# EasyEDA schematic 1-Schematic_STM32 Modified.json
TITLE: STM32F103C8T6 Blue Board; REV: 1.1; Date: 2019-03-03; Sheet: 1/1; Drawn By: r3bers; Company: https://solovjov.net
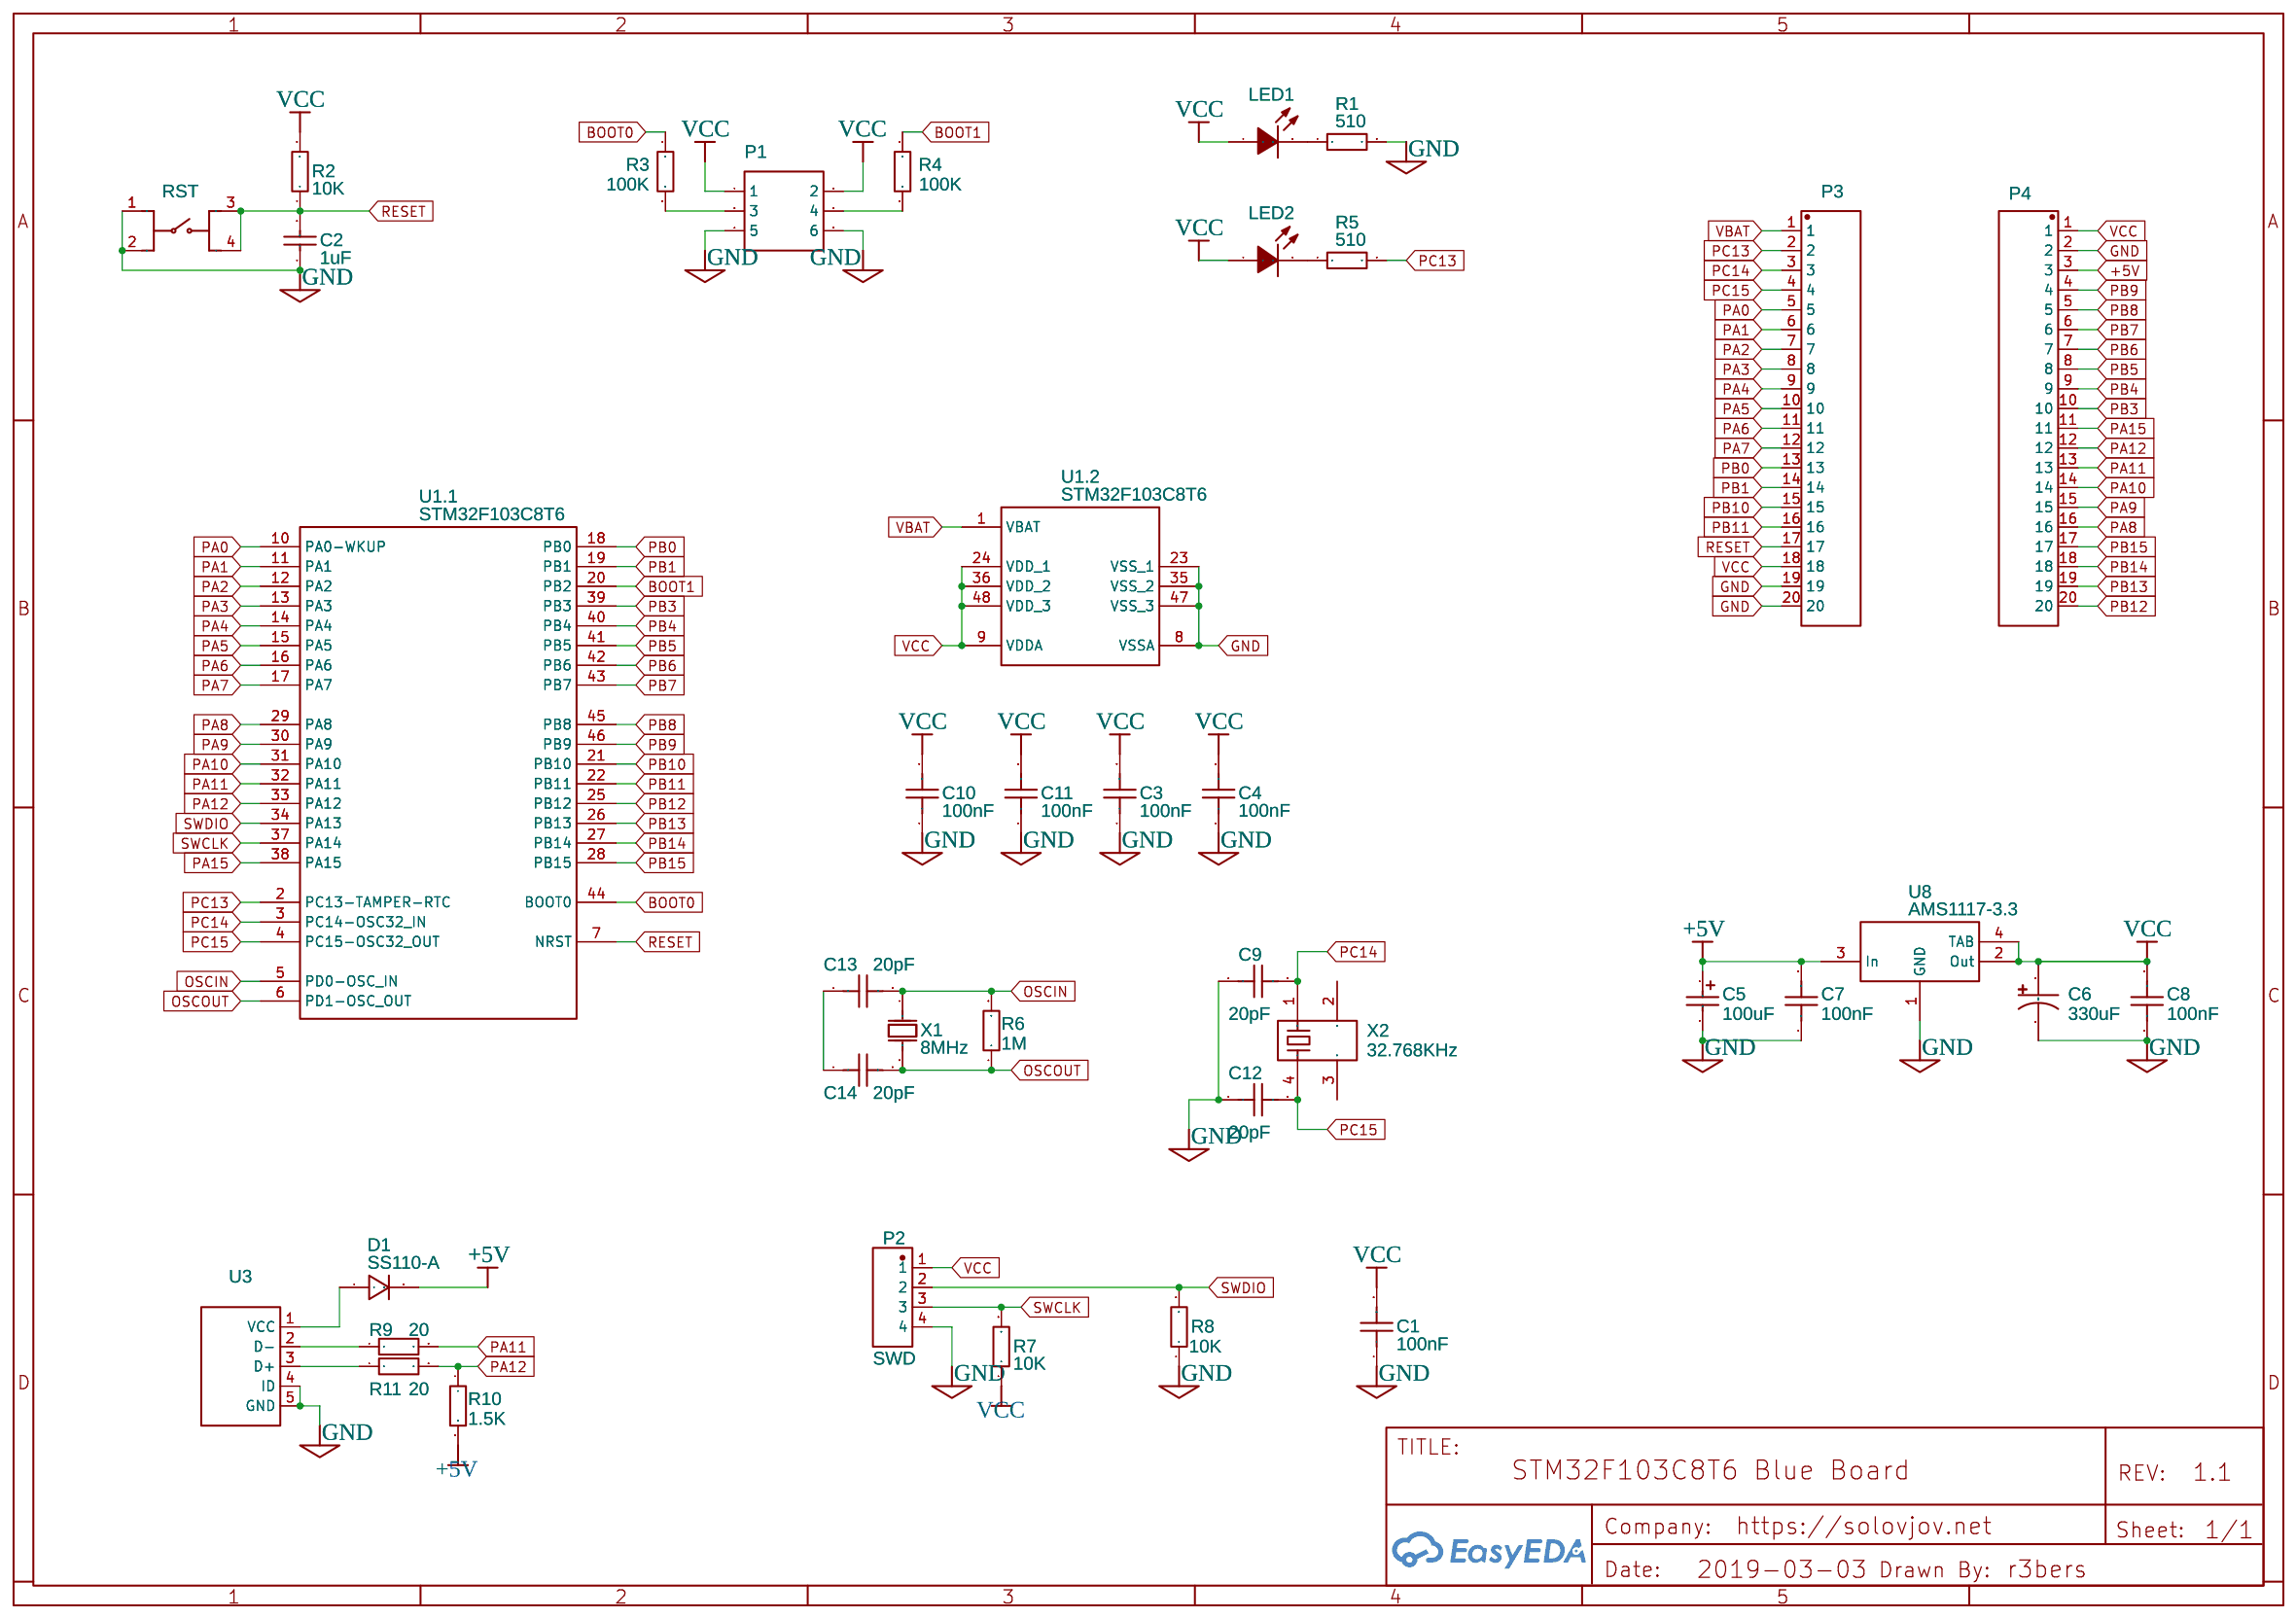
[diagram p0: schematic sheet]

## Parts
C1  100nF  [0603_1608METRIC_PAD1.05X0.95MM_HANDSOLDER]
C2  1uF  [0603_1608METRIC_PAD1.05X0.95MM_HANDSOLDER]
C3  100nF  [0603_1608METRIC_PAD1.05X0.95MM_HANDSOLDER]
C4  100nF  [0603_1608METRIC_PAD1.05X0.95MM_HANDSOLDER]
C5  100uF  [CASE-C_6032]
C6  330uF  [CASE-C_6032]
C7  100nF  [0603_1608METRIC_PAD1.05X0.95MM_HANDSOLDER]
C8  100nF  [0603_1608METRIC_PAD1.05X0.95MM_HANDSOLDER]
C9  20pF  [0603_1608METRIC_PAD1.05X0.95MM_HANDSOLDER]
C10  100nF  [0603_1608METRIC_PAD1.05X0.95MM_HANDSOLDER]
C11  100nF  [0603_1608METRIC_PAD1.05X0.95MM_HANDSOLDER]
C12  20pF  [0603_1608METRIC_PAD1.05X0.95MM_HANDSOLDER]
C13  20pF  [0603_1608METRIC_PAD1.05X0.95MM_HANDSOLDER]
C14  20pF  [0603_1608METRIC_PAD1.05X0.95MM_HANDSOLDER]
D1  SS110-A  [SMA(DO-214AC)]
LED1  XL-0603QYGC  [LED-0603]
LED2  XL-0603QYGC  [LED-0603]
P1  HDR-IDC-2.54-2X3P  [HEADER-2.54-P2×3]
P2  SWD  [HEADER-2.54-P4-ANG]
P3  210S-1*20P L=11.6MMGold-plated black  [HEADER-2.54-P20]
P4  210S-1*20P L=11.6MMGold-plated black  [HEADER-2.54-P20]
R1  510  [0603_1608METRIC_PAD1.05X0.95MM_HANDSOLDER]
R2  10K  [0603_1608METRIC_PAD1.05X0.95MM_HANDSOLDER]
R3  100K  [0603_1608METRIC_PAD1.05X0.95MM_HANDSOLDER]
R4  100K  [0603_1608METRIC_PAD1.05X0.95MM_HANDSOLDER]
R5  510  [0603_1608METRIC_PAD1.05X0.95MM_HANDSOLDER]
R6  1M  [0603_1608METRIC_PAD1.05X0.95MM_HANDSOLDER]
R7  10K  [0603_1608METRIC_PAD1.05X0.95MM_HANDSOLDER]
R8  10K  [0603_1608METRIC_PAD1.05X0.95MM_HANDSOLDER]
R9  20  [0603_1608METRIC_PAD1.05X0.95MM_HANDSOLDER]
R10  1.5K  [0603_1608METRIC_PAD1.05X0.95MM_HANDSOLDER]
R11  20  [0603_1608METRIC_PAD1.05X0.95MM_HANDSOLDER]
RST  K2-6639SP-C4SC-04  [KEY-6.0*6.0]
U1  STM32F103C8T6  [ST-LQFP48]  (sections 1,2)
U3  Micro USB-B 5P_C40942  [USB-MICROB]
U8  AMS1117-3.3  [SOT-223]
X1  8MHz  [OSC-49S-1]
X2  32.768KHz  [MC-306]

## Library data of the parts
C1 C3 C4 C7 C8 C10 C11 = CL10B104KA8NNNC: Supplier: LCSC; Manufacturer: SAMSUNG; Supplier Part: C1590
C2 = CL10A105KO8NNNC: Supplier: LCSC; Manufacturer: SAMSUNG; Supplier Part: C1592
C5 = CA45-C016K107T: Supplier: LCSC; Manufacturer: Xiangyee; Contributor: LCSC; Supplier Part: C122646
C6 = CA45-C6R3K337T: Supplier: LCSC; Supplier Part: C201144; Manufacturer: Hunan Xiangyee in S&T; Contributor: LCSC
C9 C12-C14 = 0603CG200J500NT: Supplier: LCSC; Manufacturer: FH; Supplier Part: C91702
D1 = -: Supplier Part: C143192; Supplier: LCSC; Manufacturer: FMS; Contributor: LCSC
LED1 LED2 = -: Supplier: LCSC; Manufacturer: KENTO; image: //image.lceda.cn/szlcsc/C2289.jpg; Supplier Part: C2289
P1 = -: Supplier: LCSC; Manufacturer: BOOMELE; Manufacturer Part: 2X3 2.54mm IDC Box; image: //image.lceda.cn/szlcsc/C11214.jpg; Supplier Part: C11214
P2 = -: Supplier: LCSC; Manufacturer: ZHENGLING; Manufacturer Part: Z-211-0411-0021-001; Contributor: LCSC; Supplier Part: C152150
P3 P4 = -: Supplier: LCSC; Manufacturer: Ckmtw; Contributor: LCSC; Supplier Part: C124374
R1 R5 = RC0603FR-07510RL: Supplier: LCSC; Manufacturer: YAGEO; Supplier Part: C114670
R2 R7 R8 = RC0603JR-0710KL: Supplier: LCSC; Manufacturer: YAGEO; Supplier Part: C99198
R3 R4 = RC0603FR-07100KL: Supplier: LCSC; Supplier Part: C14675; Manufacturer: YAGEO; Contributor: LCSC
R6 = 0603WAJ0105T5E: Supplier: LCSC; Manufacturer: UniOhm; Supplier Part: C26098
R9 R11 = RS-03K20R0FT: Supplier: LCSC; Manufacturer: FH; Supplier Part: C136605
R10 = 0603WAJ0152T5E: Supplier: LCSC; Manufacturer: UniOhm; Supplier Part: C25989
RST = -: Supplier: LCSC; Manufacturer: HRO; Supplier Part: C83206
U1 = -: tags: STM32; Supplier Part: C8734; Supplier: LCSC; Manufacturer: ST; subpart_no: 1; image: http://image.lceda.cn/szlcsc/C8734.jpg
U3 = -: Supplier: LCSC; Manufacturer: ValuePro; image: //image.lceda.cn/szlcsc/C40942.jpg; Supplier Part: C40942
U8 = -: sourceId: dwIGgezVh; Supplier Part: C6186; Supplier: LCSC; Manufacturer: AMS; LCSC Assembly: Yes; image: //image.lceda.cn/szlcsc/C6186.jpg
X1 = X49SD8MSD2SC: Supplier: LCSC; Manufacturer: YXC; Supplier Part: C21263
X2 = X803832768KGD4GI: Supplier: LCSC; Manufacturer: YXC; Supplier Part: C12675

## Nets
+5V: C5.1 C7.2 D1.2 P4.3 R10.2 U8.3(In)
GND: C1.1 C2.1 C3.1 C4.1 C5.2 C6.2 C7.1 C8.1 C9.1 C10.1 C11.1 C12.1 P1.5 P1.6 P2.4 P3.19 P3.20 P4.2 R1.2 R8.1 RST.1 RST.2 U1.8(VSSA) U1.23(VSS_1) U1.35(VSS_2) U1.47(VSS_3) U3.4(ID) U3.5(GND) U8.1(GND)
VBAT: P3.1 U1.1(VBAT)
VCC: C1.2 C3.2 C4.2 C6.1 C8.2 C10.2 C11.2 LED1.1(A) LED2.1(A) P1.1 P1.2 P2.1 P3.18 P4.1 R2.2 R7.1 U1.9(VDDA) U1.24(VDD_1) U1.36(VDD_2) U1.48(VDD_3) U8.2(Out) U8.4(TAB)
BOOT0: R3.1 U1.44(BOOT0)
BOOT1: R4.1 U1.20(PB2)
OSCIN: C13.2 R6.2 U1.5(PD0-OSC_IN) X1.1(OSC1)
OSCOUT: C14.2 R6.1 U1.6(PD1-OSC_OUT) X1.2(OSC2)
PA0: P3.5 U1.10(PA0-WKUP)
PA1: P3.6 U1.11(PA1)
PA2: P3.7 U1.12(PA2)
PA3: P3.8 U1.13(PA3)
PA4: P3.9 U1.14(PA4)
PA5: P3.10 U1.15(PA5)
PA6: P3.11 U1.16(PA6)
PA7: P3.12 U1.17(PA7)
PA8: P4.16 U1.29(PA8)
PA9: P4.15 U1.30(PA9)
PA10: P4.14 U1.31(PA10)
PA11: P4.13 R9.2 U1.32(PA11)
PA12: P4.12 R10.1 R11.2 U1.33(PA12)
PA15: P4.11 U1.38(PA15)
PB0: P3.13 U1.18(PB0)
PB1: P3.14 U1.19(PB1)
PB3: P4.10 U1.39(PB3)
PB4: P4.9 U1.40(PB4)
PB5: P4.8 U1.41(PB5)
PB6: P4.7 U1.42(PB6)
PB7: P4.6 U1.43(PB7)
PB8: P4.5 U1.45(PB8)
PB9: P4.4 U1.46(PB9)
PB10: P3.15 U1.21(PB10)
PB11: P3.16 U1.22(PB11)
PB12: P4.20 U1.25(PB12)
PB13: P4.19 U1.26(PB13)
PB14: P4.18 U1.27(PB14)
PB15: P4.17 U1.28(PB15)
PC13: P3.2 R5.2 U1.2(PC13-TAMPER-RTC)
PC14: C9.2 P3.3 U1.3(PC14-OSC32_IN) X2.1
PC15: C12.2 P3.4 U1.4(PC15-OSC32_OUT) X2.4
RESET: C2.2 P3.17 R2.1 RST.3 RST.4 U1.7(NRST)
SWCLK: P2.3 R7.2 U1.37(PA14)
SWDIO: P2.2 R8.2 U1.34(PA13)
C13_1: C13.1 C14.1
LED1_2: LED1.2(K) R1.1
LED2_2: LED2.2(K) R5.1
R3_2: P1.3 R3.2
R4_2: P1.4 R4.2
U3_1: D1.1 U3.1(VCC)
U3_2: R9.1 U3.2(D-)
U3_3: R11.1 U3.3(D+)

Not connected (* = marked no-connect by the designer): X2 2 3
